# Altium schematic sheet IC204.schdoc
size 67 x 35 mm
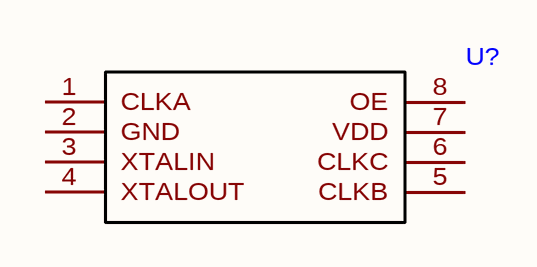
[diagram p0: IC204.schdoc]

## Parts
U?  (no value)  [SOIC-8_L4.9-W3.9-P1.27-LS6.0-BL]

## Nets

Not connected (* = marked no-connect by the designer): U? 1(CLKA) 2(GND) 3(XTALIN) 4(XTALOUT) 5(CLKB) 6(CLKC) 7(VDD) 8(OE)

## Library data of the parts
U? = IC204